# Altium schematic sheet DataVideoPort.SchDoc
size A4
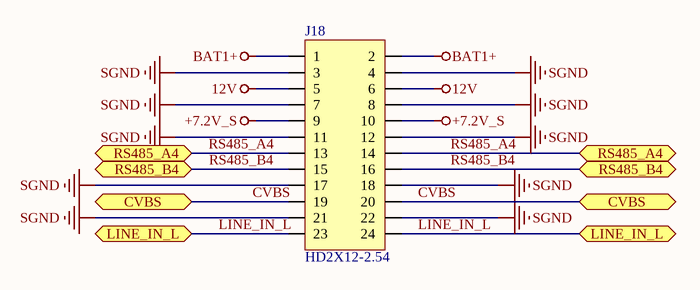
[diagram p0: DataVideoPort.SchDoc]

## Parts
J18  HD2X12-2.54  [HD2X12-2.54]

## Ports
CVBS (bidir), LINE_IN_L (bidir), RS485_A4 (bidir), RS485_B4 (bidir)

## Nets
12V: J18.5 J18.6
+7.2V_S: J18.9 J18.10
BAT1+: J18.1 J18.2
SGND: J18.3 J18.4 J18.7 J18.8 J18.11 J18.12 J18.17 J18.18 J18.21 J18.22
CVBS: J18.19 J18.20 ; port CVBS
LINE_IN_L: J18.23 J18.24 ; port LINE_IN_L
RS485_A4: J18.13 J18.14 ; port RS485_A4
RS485_B4: J18.15 J18.16 ; port RS485_B4

## Library data of the parts
J18 = HEADER2X12